# Altium project PCB_PowerSupply_1A - Copy.PrjPcb
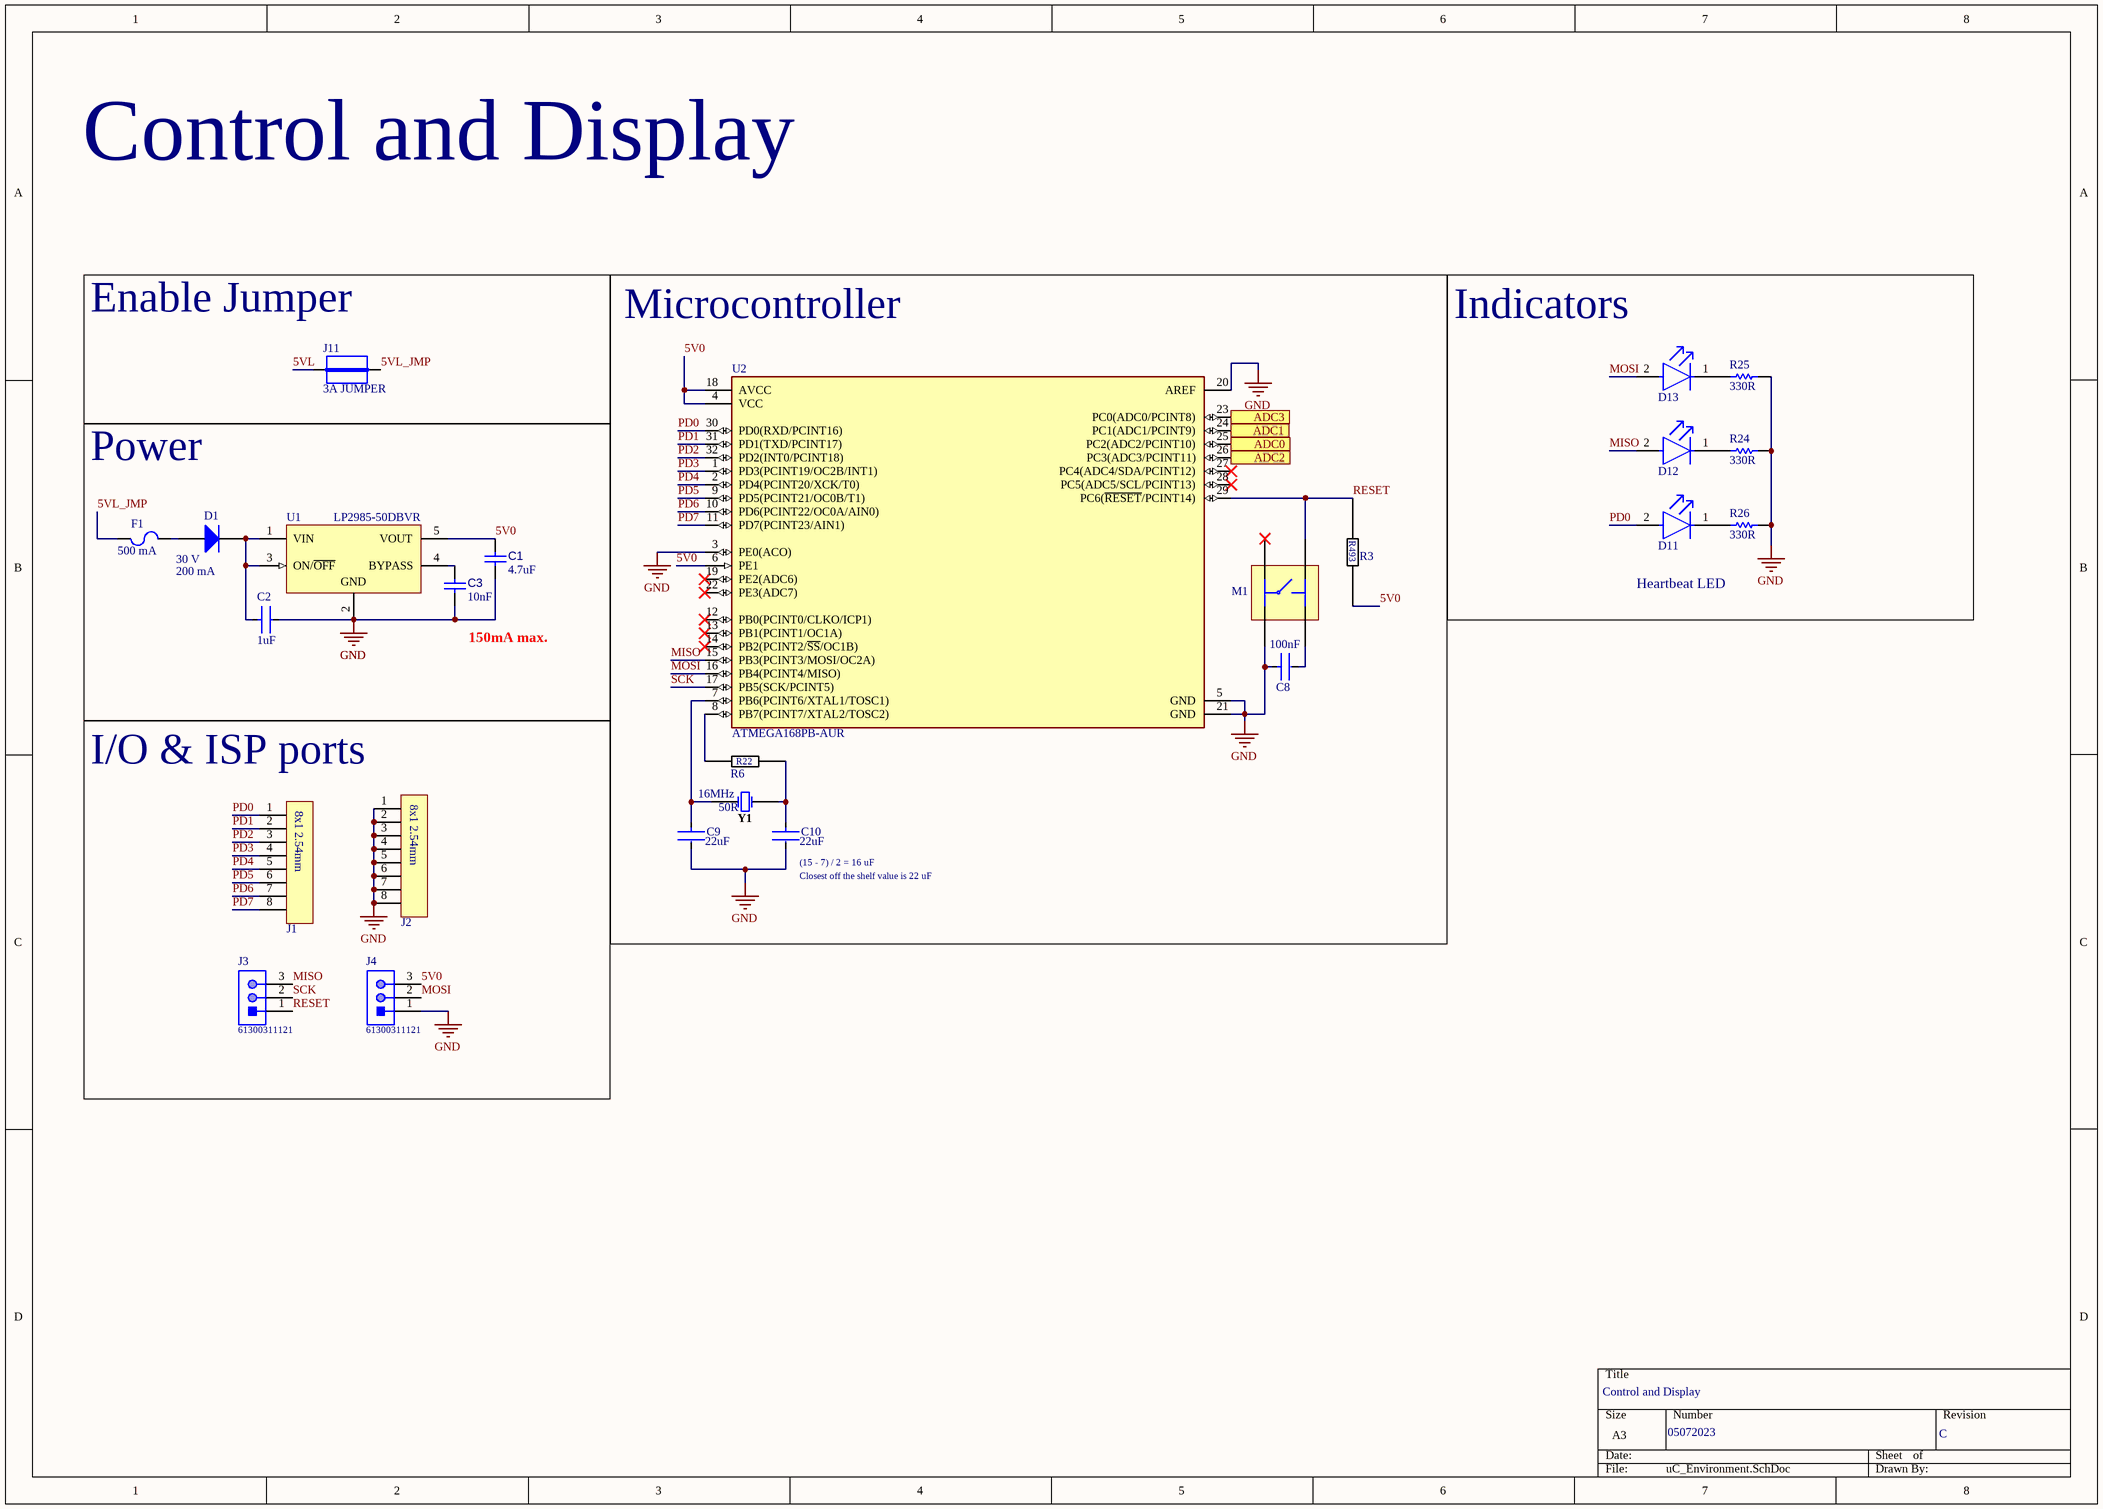
[diagram p0: uC_Environment.SchDoc]
PCB_CHECKER: - -----; PCB_CHECKER_APP_DATE: --/--/----; PCB_DESIGNER: Gustavo H. Meza; PCB_DWG_NO: <PCB DWG NO>; PCB_PART_NUMBER: <PCB PN>; PCB_REV: A; SCH_REV: A
1 sheet, 25 parts. Net scope: flat (ports and power ports of the same name join across sheets).
Board file: PowerSupply_REV1A.PcbDoc

## Sheet uC_Environment.SchDoc
size A3; SheetNumber: 1; SheetTotal: 4; ENG_APP_DATE: --/--/--; DSN_APP_DATE: --/--/--; CHK_APP_DATE: --/--/--

### Parts
C1  value 4.7uF  [CAPC3216X18N]  (hidden comment: CL31B475KAHNNNE)
C2  Capacitance: 1uF  [FP-CL10-IPC_C]  (hidden comment: CL10B105KA8NNNC)
C3  value 10nF  [CAPC2012X08N]  (hidden comment: CL21B103KAANNNC)
C8  Capacitance: 100nF  [FP-CL21-IPC_C]  (hidden comment: CL21B104KBCNNNC)
C9  Capacitance: 22uF  [FP-C2012-125-0_2-MFG]  (hidden comment: C2012X5R1V226M125AC)
C10  Capacitance: 22uF  [FP-C2012-125-0_2-MFG]  (hidden comment: C2012X5R1V226M125AC)
D1  Parameter 1: 30 V  Parameter 2: 200 mA  [ONSC-SOD-523-2-502-01_V]  (hidden comment: RB521S30T1G)
D11  LTST-C191TBKT  [FP-LTST-C191TBKT-MFG]  (value not drawn)
D12  LTST-C191TBKT  [FP-LTST-C191TBKT-MFG]  (value not drawn)
D13  LTST-C191TBKT  [FP-LTST-C191TBKT-MFG]  (value not drawn)
F1  Parameter 1: 500 mA  [0ZCJ0050AF2E-Footprint-1]  (hidden comment: 0ZCJ0050AF2E)
J1  M22-2010805  [M22-2010805-Footprint-1]  (value not drawn)
J2  M22-2010805  [M22-2010805-Footprint-1]  (value not drawn)
J3  61300311121  [61300311121]
J4  61300311121  [61300311121]
J11  3A JUMPER  [3A JUMPER-Footprint-1]
M1  PTS815SJK250SMTRLFS  [PTS815SJK250SMTRLFS-Footprint-1]  (value not drawn)
R3  RC0805FR-074K99L  [RESC2012X06N]  (value not drawn)
R6  RC0805JR-0722RL  [RESC2012X06N]  (value not drawn)
R24  Resistance: 330R  [RESC1608X55X30LL15T15]  (hidden comment: ERJ-3EKF3300V)
R25  Resistance: 330R  [RESC1608X55X30LL15T15]  (hidden comment: ERJ-3EKF3300V)
R26  Resistance: 330R  [RESC1608X55X30LL15T15]  (hidden comment: ERJ-3EKF3300V)
U1  LP2985-50DBVR  [DBV0005A_M]
U2  ATMEGA168PB-AUR  [FP-32A-MFG]
Y1  Frequency: 16MHz  ESR (Equivalent Series Resistance): 50R  [ECS-160-20-3X-EN-TR-Footprint-1]  (hidden comment: ECS-160-20-3X-EN-TR)

### Blocks framed on the sheet
Enable Jumper: J11
Microcontroller: C8-C10 M1 R3 R6 U2 Y1
Indicators: D11-D13 R24-R26
Power: C1-C3 D1 F1 U1
I/O & ISP ports: J1-J4

### Ports
ADC0 (in), ADC1 (in), ADC2 (in), ADC3 (in)

### Nets
GND: C1.2 C2.2 C3.1 C8.1 C9.2 C10.2 J2.1 J2.2 J2.3 J2.4 J2.5 J2.6 J2.7 J2.8 J4.1 M1.0(A1) R24.1 R25.1 R26.1 U1.2(GND) U2.3(PE0(ACO)) U2.5(GND) U2.20(AREF) U2.21(GND)
5V0: C1.1 J4.3 R3.2 U1.5(VOUT) U2.4(VCC) U2.6(PE1) U2.18(AVCC)
5VL: J11.1
5VL_JMP: F1.1(IN) J11.2
MISO: D12.2(A) J3.3 U2.15(PB3(PCINT3/MOSI/OC2A))
MOSI: D13.2(A) J4.2 U2.16(PB4(PCINT4/MISO))
PD0: D11.2(A) J1.1 U2.30(PD0(RXD/PCINT16))
PD1: J1.2 U2.31(PD1(TXD/PCINT17))
PD2: J1.3 U2.32(PD2(INT0/PCINT18))
PD3: J1.4 U2.1(PD3(PCINT19/OC2B/INT1))
PD4: J1.5 U2.2(PD4(PCINT20/XCK/T0))
PD5: J1.6 U2.9(PD5(PCINT21/OC0B/T1))
PD6: J1.7 U2.10(PD6(PCINT22/OC0A/AIN0))
PD7: J1.8 U2.11(PD7(PCINT23/AIN1))
RESET: J3.1 M1.3(B2) R3.1 U2.29(PC6(~{RESET}/PCINT14))
SCK: J3.2 U2.17(PB5(SCK/PCINT5))
NetC2_1: C2.1 D1.1(K) U1.1(VIN) U1.3(ON/~{OFF})
NetC3_2: C3.2 U1.4(BYPASS)
NetC8_2: C8.2 M1.2(A2)
NetC9_1: C9.1 U2.7(PB6(PCINT6/XTAL1/TOSC1)) Y1.2
NetC10_1: C10.1 R6.2 Y1.1
NetD1_2: D1.2(A) F1.2(OUT)
NetD11_1: D11.1(C) R26.2
NetD12_1: D12.1(C) R24.2
NetD13_1: D13.1(C) R25.2
NetR6_1: R6.1 U2.8(PB7(PCINT7/XTAL2/TOSC2))
NetU2_23: U2.23(PC0(ADC0/PCINT8)) ; port ADC3
NetU2_24: U2.24(PC1(ADC1/PCINT9)) ; port ADC1
NetU2_25: U2.25(PC2(ADC2/PCINT10)) ; port ADC0
NetU2_26: U2.26(PC3(ADC3/PCINT11)) ; port ADC2

Not connected (* = marked no-connect by the designer): M1 1(B1)*; U2 12(PB0(PCINT0/CLKO/ICP1))* 13(PB1(PCINT1/OC1A))* 14(PB2(PCINT2/~{SS}/OC1B))* 19(PE2(ADC6))* 22(PE3(ADC7))* 27(PC4(ADC4/SDA/PCINT12))* 28(PC5(ADC5/SCL/PCINT13))*

### Notes on the sheet
- Control and Display
- Heartbeat LED
- 150mA max.
- (near C10) (15 - 7) / 2 = 16 uF
- (near C10) Closest off the shelf value is 22 uF
- 05072023
- C
- DWG. NO.
- REV.
- SHT.
- THIS DOCUMENT AND THE DATA DISCLOSED HEREIN OR HEREWITH IS THE PROPERTY OF ALTIUM LIMITED AND MAY BE FREELY DISTRIBUTED IN WHOLE. NO RIGHTS ARE RESERVED OR EXPRESS OR IMPLIED WARANTEE GIVEN.
- REVISION
- DESCRIPTION
- DATE
- APPROVED
- ENG:
- APPROVALS
- PROJECT
- DSN:
- CHK:
- REFERENCE DOCUMENTS
- PROJECT REVISION:
- TITLE
- DOCUMENT REVISION:
- DESIGN ITEM:
- BOM:
- FAB DWG:
- PCB DWG:
- ASSY DWG:
- SCALE:
- SIZE
- B
- CAGE CODE
- FILE NAME
- DWG NO.
- SHEET
- OF
- REV
- (in symbol CMP-002-00071-2) 8x1 2.54mm
- (in symbol CMP-009-00177-2) R22
- (in symbol CMP-009-00178-3) R493

### Library data of the parts
C1 = CMP-001-00083-1: Ceramic capacitor SMD 1206 - 4700nF/25V, +-10%, X7R, Samsung, RoHS; Case Code (Metric): 3216; Case/Package: 1206; Case Code (Imperial): 1206
C2 = CMP-13271-000007-2: CAP CER 1UF 25V X7R 0603; Tolerance: 10%; Width: 0.031inch; Packaging: Tape and Reel; Package Quantity: 1; Case/Package: 0603; Series: CL; Case Code (Imperial): 0603; Radiation Hardening: No; Thickness: 0.035inch; Case Code (Metric): 1608; Min Operating Temperature: -55°C; Depth: 0.8mm; RoHS Compliant: Yes; Height: 0.8mm; Mount: Surface Mount; Construction: Flat; Length: 1.6mm; Max Operating Temperature: 125°C; Voltage: 25V; Dielectric: X7R; Contact Plating: Tin; Voltage Rating: 25V
C3 = CMP-001-00084-1: Cap Ceramic 0.01uF 25V X7R 10% SMD 0805 125°C Paper T/R; Case Code (Imperial): 0805; Case Code (Metric): 2012; Case/Package: 0805
C8 = CMP-2000-05017-2: CL21 Series 0805 100nF 50V ±10% Tolerance X7R Multilayer Ceramic Chip Capacitor; Depth: 1.25mm; Height: 0.85mm; Width: 0.049inch; Tolerance: 10%; Case Code (Metric): 2012; Case Code (Imperial): 0805; Material: Ceramic; Thickness: 0.037inch; Min Operating Temperature: -55°C; Contact Plating: Tin; Length: 2mm; Mount: Surface Mount; Voltage Rating (DC): 50V; Lead Free: Lead Free; Dielectric: X7R; Radiation Hardening: No; Voltage Rating: 50V; Case/Package: 0805; Packaging: Tape and Reel; Max Operating Temperature: 125°C; Voltage: 50V
C9 C10 = CMP-2000-06038-3: Multilayer Ceramic Capacitors 22μF ±20% 35V X5R SMD 0805; Tolerance: 20%; RoHS Compliant: Yes; Height: 1.25mm; Termination: SMD/SMT; Case/Package: 0805; Thickness: 0.057inch; Max Operating Temperature: 85°C; Min Operating Temperature: -55°C; Voltage Rating (DC): 35V; Length: 0.079inch; Dielectric: X5R; Dielectric Material: Ceramic; Voltage Rating: 35V; Mount: Surface Mount; Package Quantity: 2000; Lead Free: Lead Free; Weight: 0.000194oz; REACH SVHC: No SVHC; Width: 0.049inch; Packaging: Tape and Reel; Series: C; Case Code (Metric): 2012; Case Code (Imperial): 0805
D1 = CMP-1051-00018-1: Schottky Barrier Diode, 2-Pin SOD-523, Pb-Free, Tape and Reel; Manufacturer: On Semiconductor; Configuration: Single; IFSM Max (A): 1; Mounting Technology: Surface Mount; ComponentLink1Description: Manufacturer URL; PackageReference: SOD-523-2-502-01; RoHS: TRUE; ComponentLink3Description: Package Specification; ComponentLink2Description: Datasheet; PackageVersion: Rev. E, 09/2010; PartNumber: RB521S30T1G; ComponentLink3URL: http://www.onsemi.com/pub_link/Collateral/502-01.PDF; ComponentLink1URL: http://www.onsemi.com/; PackageDescription: 2-Pin SOD, Body 1.2 x 0.8 mm; DatasheetVersion: Rev. 8; ComponentLink2URL: http://www.onsemi.cn/pub_link/Collateral/RB521S30T1-D.PDF; Packing: Tape and Reel
D11-D13 = CMP-22017-000008-1: LED BLUE CLEAR CHIP SMD; Lens Color: Colorless; Dominant Wavelength: 475nm; Forward Current: 20mA; Wavelength: 468nm; Viewing Angle: 130°; Power Dissipation: 76mW; Luminous Intensity: 180mcd; Reverse Voltage: 5V; Number of Elements: 1; Lens Style: Diffused; Forward Voltage: 3.8V; Max Power Dissipation: 75mW; Case Code (Metric): 1608; Packaging: Tape and Reel; Case/Package: 0603; Depth: 1.6mm; Mount: Surface Mount; Lead Free: Lead Free; Min Operating Temperature: -20°C; Lens Transparency: Clear; Illumination Color: Blue; Height: 0.55mm; Test Current: 20mA; Case Code (Imperial): 0603; Max Operating Temperature: 80°C; Number of Pins: 2; Length: 0.8mm; Radiation Hardening: No; Package Quantity: 1; Number of LEDs: 1; Width: 0.8mm; Color: Blue
F1 = CMP-005-00013-2: PTC Resettable Fuse 0.5A(hold) 1A(trip) 24VDC 100A 0.6W 0.1s 0.15Ohm SMD Solder Pad 3.5 X 1.8 X 1.3mm T/R; Approvals: UL,TUV; Case Code (Metric): 3216; Case Code (Imperial): 1206; Case/Package: 1206
J1 J2 = CMP-002-00071-2: Connector, Header, 8Pos, 1Row, 2Mm Rohs Compliant: Yes; Case/Package: SIL; Contact Plating: Gold; Contact Material: Bronze; Contact Finish - Mating: GOLD
J3 J4 = CMP-1502-01062-1: THT Vertical Pin Header WR-PHD, Pitch 2.54 mm, Single Row, 3 pins; Manufacturer: Wurth Elektronik; Withstanding Voltage: 500VAC; Working Voltage: 250VAC; Rated Current: 3A; Pitch: 2.54mm; Pin Number: 3; Gender: Male; Contact Resistance: 20mOhm; Package Reference: 61300311121; Manufacturer URL: http://www.we-online.de; Datasheet URL: https://katalog.we-online.de/em/datasheet/6130xx11121.pdf; Operating Temperature: -40to105degC; Part Number: 61300311121; Orientation: Vertical; Packaging: Bag; Row Number: Single; Mounting Technology: THT; Publisher: WurthElektronik
J11 = CMP-002-00072-1
M1 = CMP-011-00013-2: Switch Tactile N.O. SPST Button J-Bend 0.05A 12VDC 2.45N SMD T/R; Illumination Type: Non-Illuminated; Mechanical Life: 50000Cycles; Max Operating Temperature: 70°C; Min Operating Temperature: -20°C
R3 = CMP-009-00178-3: Res Thick Film 0805 4.99K Ohm 1% 0.125W(1/8W) ±100ppm/C Epoxy Pad SMD T/R; Construction: Rectangular; Case/Package: 0805; Case Code (Metric): 2012; Case Code (Imperial): 0805
R6 = CMP-009-00177-2: Res Thick Film 0805 22 Ohm 5% 0.125W(1/8W) ±100ppm/C Pad SMD T/R; Case Code (Imperial): 0805; Case Code (Metric): 2012; Case/Package: 0805; Contact Plating: Tin,Lead
R24-R26 = CMP-2000-00435-2: Chip Resistor, 330 Ohm, +/- 1%, 0.1 W, -55 to 155 degC, 0603 (1608 Metric), RoHS, Tape and Reel; Gender: Male; Mating Cycles: 10000; Current Rating: 500 mA; Voltage Rating: 10 V; REACH SVHC: No SVHC; PackageDescription: 2-Pin Surface Mount Device, Body 1.6 x 0.85 mm; Contact Finish: Gold; Pins: 8; ComponentLink1Description: Manufacturer URL; Packaging: Tape and Reel; Max Operating Temperature: 85 degC; Contact Material: Copper; Height: 1.45 mm; Width: 1.45 mm; DatasheetVersion: Apr-15; Package Quantity: 1500; Contact Plating: Gold; PackageReference: 0603; Mount: Surface Mount; Lead Pitch: 1.1 mm; Min Operating Temperature: -25 degC; ComponentLink1URL: http://www.panasonic.com/; ComponentLink2URL: http://industrial.panasonic.com/cdbs/www-data/pdf/RDA0000/AOA0000C86.pdf; Length: 13.7 mm; ComponentLink2Description: Datasheet; RoHSCompliant: true
U1 = CMP-0758-00084-2: Single Output Low Noise LDO, 150 mA, Fixed 5 V Output, 1.5% Tolerance, 2.2 to 16 V Input, Low IQ, 5-Pin SOT-23 (DBV), -40 to 125 degC, Green (RoHS & no Sb/Br), Tape and Reel; Manufacturer: Texas Instruments; Accuracy (%): 1.5; Iout (Max) (A): 0.15; Fixed Output Options (V): 5; Vdo (Typ) (mV): 280; Output Options: Fixed Output; Iq (Typ) (mA): 0.85; DatasheetVersion: SLVS522N; PackageDescription: 5-Pin Plastic Small Outline, Body 2.9 x 1.6 mm, Pitch 0.95 mm; RoHS: TRUE; ComponentLink3URL: http://www.ti.com/litv/pdf/mpds018j; PartNumber: LP2985-50DBVR; PackageReference: DBV0005A; ComponentLink2URL: http://www.ti.com/lit/ds/symlink/lp2985-50.pdf; Mounting Technology: Surface Mount; ComponentLink1Description: Manufacturer URL; Vin (V): 2.2 to 16; ComponentLink3Description: Package Specification; ComponentLink1URL: http://www.ti.com/; PackageVersion: 4073253-4/L; ComponentLink2Description: Datasheet; Packing: Tape and Reel; Operating Temperature Range (degC): -40 to 125
U2 = CMP-06276-000190-1: IC MCU 8BIT 16KB FLASH 32TQFP; RoHS Compliant: Yes
Y1 = CMP-003-00030-1: Crystal 16MHz ±30ppm (Tol) ±50ppm (Stability) 20pF FUND 50Ohm 2-Pin HC-49/USX SMD T/R; Frequency Tolerance: 30ppm; Frequency Stability: 50ppm